# Altium schematic sheet Power Distrubition.SchDoc
size A4; SheetNumber: 3; SheetTotal: 4
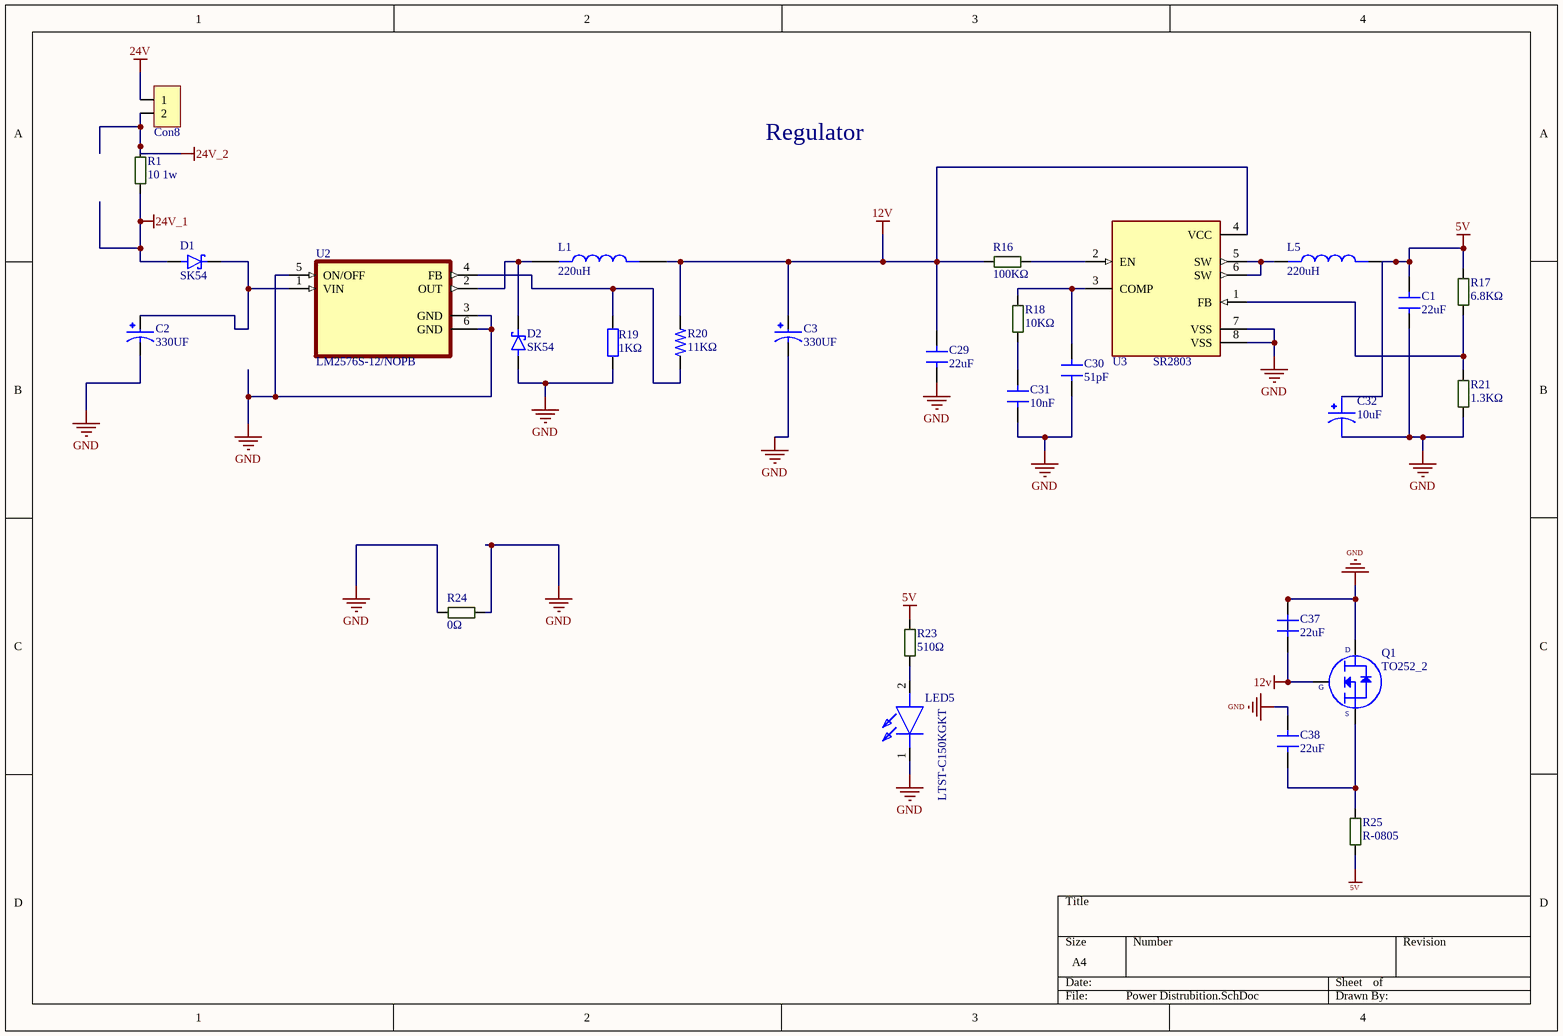
[diagram p0: Power Distrubition.SchDoc]

## Parts
C1  22uF  [C-0805]
C2  330UF  [CAP_EEETC1C331V]
C3  330UF  [CAP_EEETC1C331V]
C29  22uF  [C-0805]
C30  51pF  [C-0603W]
C31  10nF  [C-0805]
C32  10uF  [CapSmdElc]
C37  22uF  [C-0805]
C38  22uF  [C-0805]
Con8  Connector2_1  [Conn]  (value not drawn)
D1  SK54  [DIOM7959X265N]
D2  SK54  [DIOM7959X265N]
L1  220uH  [IND_MDH12577C-101MA=P3]
L5  220uH  [IND_MDH12577C-101MA=P3]
LED5  LTST-C150KGKT  [LED1206]
Q1  TO252_2  [TO-252]
R1  10 1w  [R-2512]
R16  100KΩ  [R-0805]
R17  6.8KΩ  [R-0603R]
R18  10KΩ  [R-0805]
R19  Deger: 1KΩ  [R-0805]  (hidden comment: RES SMD 1K OHM 1% 1/8W 0805)
R20  11KΩ  [R-0805]
R21  1.3KΩ  [R-0603R]
R23  510Ω  [R-0603R]
R24  0Ω  [R-2512]
R25  R-0805  [R-0805W]
U2  LM2576S-12/NOPB  [VREG_TPS79625KTTR]
U3  SR2803  [SOP127P600X175-8N]

## Nets
5V: C1.2 C32.1 L5.2 R17.2 R23.2 R25.1
12v: C3.1 C29.2 C37.1 L1.2 Q1.1 R16.2 R20.2 U3.4(VCC)
24V: Con8.1
24V_1: D1.A R1.1
24V_2: Con8.2 R1.2
GND: C1.1 C2.2 C3.2 C29.1 C30.1 C31.1 C32.2 C37.2 C38.2 D2.A LED5.1(K) Q1.4 R19.1 R21.1 R24.1 R24.2 U2.3(GND) U2.5(ON/OFF) U2.6(GND) U3.7(VSS) U3.8(VSS)
NetC2_1: C2.1 D1.C(K) U2.1(VIN)
NetC30_2: C30.2 R18.2 U3.3(COMP)
NetC31_2: C31.2 R18.1
NetC38_1: C38.1 Q1.3 R25.2
NetD2_C: D2.C(K) L1.1 U2.2(OUT)
NetL5_1: L5.1 U3.5(SW) U3.6(SW)
NetLED5_2: LED5.2(A) R23.1
NetR16_1: R16.1 U3.2(EN)
NetR17_1: R17.1 R21.2 U3.1(FB)
NetR19_2: R19.2 R20.1 U2.4(FB)

## Notes on the sheet
- Regulator
- (in symbol TO252_2) D; G; S

## Library data of the parts
C1 C29 C31 C37 C38 = C-0805
C2 C3 = CAP 330UF SMD: CAP ALUM 330UF 20% 16V SMD; MP: EEE-TC1C331V; MF: Panasonic Electronic Components; Value: *; Package: RADIAL-2 Panasonic; Availability: In Stock; SnapEDA_Link: https://www.snapeda.com/parts/EEE-TC1C331V/Panasonic/view-part/6178283/?ref=snap; Price: None; Purchase-URL: https://pricing.snapeda.com/search/part/EEE-TC1C331V/?ref=eda; Check_prices: https://www.snapeda.com/parts/EEE-TC1C331V/Panasonic/view-part/6178283/?ref=eda
C30 = C-0603
C32 = 100 uF Electr Cap
D1 D2 = SK54: Diode Schottky 40V 5A Surface Mount DO-214AA (SMB); MP: MBRS320T3G; MF: ON Semiconductor; Package: DO-214 ON Semiconductor; Availability: Good; Arrow_Electronics-Purchase-URL: https://snapeda.com/shop?store=Arrow+Electronics&id=432205; SnapEDA_Link: https://www.snapeda.com/parts/MBRS320T3G/ON%20Semiconductor/view-part/432205/?ref=snap; DigiKey-Purchase-URL: https://snapeda.com/shop?store=DigiKey&id=432205; Mouser-Purchase-URL: https://snapeda.com/shop?store=Mouser&id=432205; Value: *; Price: None
L1 L5 = 220uH Inductor SMD: Inductor Power Shielded Wirewound 220uH 20% 100KHz Ferrite 1.1A 0.325Ohm DCR 5049 Automotive T/R; MP: MDH12577C-101MA=P3; Package: None; Price: None; Value: *; Availability: Unavailable
LED5 = LTST-C150KGKT: LED; Manufacturer_Name: Lite-On; Datasheet Link: http://optoelectronics.liteon.com/upload/download/ds22-2000-072/ltst-c150kgkt.pdf; Height: 1.2mm; Manufacturer_Part_Number: LTST-C150KGKT; Mouser Part Number: 859-LTST-C150KGKT; Mouser Price/Stock: https://www.mouser.com/Search/Refine.aspx?Keyword=859-LTST-C150KGKT; RS Part Number: 6920871; RS Price/Stock: https://uk.rs-online.com/web/p/products/6920871
Q1 = TO252_2: Manufacturer: Infineon; Manufacturer Part Number: IRF3205STRLPBF; Drain to Source Voltage (Vdss): 55V; Continuous Drain Current (ID): 110A; Rds On Max: 8mR; Input Capacitance: 3.247nF; Max Power Dissipation: 200W; Turn-Off Delay Time: 50ns; Turn-On Delay Time: 14ns; Gate to Source Voltage (Vgs): 20V; Threshold Voltage: 4V; Supplier 1: Digi-Key; RoHS: Yes; Stock 1: 3281; Pricing 1: 1 = 1,84000, 10 = 1,66600, 100 = 1,33840 (USD); Mount: Surface Mount; Case/Package: D2PAK; Number of Pins: 3; Min Operating Temperature: -55°C; Max Operating Temperature: 175°C; Packaging: Cut Tape; Power Dissipation: 200W; Drain to Source Resistance: 8mR; Drain to Source Breakdown Voltage: 55V; Length: 0.42inch; Height: 0.19inch; Width: 0.38inch; REACH SVHC: No SVHC; Lead Free: Lead Free; ComponentLink1URL: https://www.alliedelec.com/m/d/b8827ca43655240244f0cc5c2198e6b1.pdf?src-supplier=Allied+Electronics; ComponentLink1Description: https://www.alliedelec.com/m/d/b8827ca43655240244f0cc5c2198e6b1.pdf?src-supplier=Allied+Electronics; ComponentLink2URL: https://www.infineon.com/dgdl/irf3205spbf.pdf?fileId=5546d462533600a4015355defac9190c&src-supplier=Digi-Key; ComponentLink2Description: https://www.infineon.com/dgdl/irf3205spbf.pdf?fileId=5546d462533600a4015355defac9190c&src-supplier=Digi-Key; ComponentLink3URL: http://www.infineon.com/dgdl/irf3205spbf.pdf?fileId=5546d462533600a4015355defac9190c&src-supplier=Digi-Key; ComponentLink3Description: http://www.infineon.com/dgdl/irf3205spbf.pdf?fileId=5546d462533600a4015355defac9190c&src-supplier=Digi-Key; ComponentLink4URL: http://www.farnell.com/datasheets/1884183.pdf?src-supplier=Element14; ComponentLink4Description: http://www.farnell.com/datasheets/1884183.pdf?src-supplier=Element14; Supplier Part Number 1: IRF3205STRLPBFCT-ND
R1 = R-2512
R16 R18 = R-0805
R17 R21 R23 = R-0603
R19 = 1K 0805: 1 kOhms ±1% 0.125W, 1/8W Chip Resistor 0805 (2012 Metric) Moisture Resistant Thick Film; Cins: Direnc; Uretici Kodu: RC0805FR-071KL; Kılıf: 0805; -Sicaklik: -55; +Sicaklik: +155; Lehim Yöntemi: SMD; MSL: 1 (Unlimited)
R20 = RES 11KΩ SMD: THICK FILM RESISTOR, 11KOHM, 125mW, 5%; MP: CRCW080511K0JNEA; Package: None; Price: None; Value: *; Availability: Unavailable
R24 = R-2512: 10 1w
U2 = LM2576S-12/NOPB: SIMPLE SWITCHER&reg; 40V, 3A Low Component Count Step-Down Regulator 5-DDPAK/TO-263 -40 to 125; MF: Texas Instruments; Availability: Warning; SnapEDA_Link: https://www.snapeda.com/parts/LM2576S-12/NOPB/Texas%20Instruments/view-part/470772/?ref=snap; Mouser-Purchase-URL: https://snapeda.com/shop?store=Mouser&id=470772; Texas_Instruments-Purchase-URL: https://snapeda.com/shop?store=Texas+Instruments&id=470772; Value: *; Price: None; Package: TO-263-5 Texas Instruments; DigiKey-Purchase-URL: https://snapeda.com/shop?store=DigiKey&id=470772; MP: LM2576S-12/NOPB; BuyPart: https://www.snapeda.com/parts/LM2576S-12/NOPB/Texas%20Instruments/view-part/470772/?ref=eda
U3 = SR2803: 330KHZ, 3A SYNCHRONOUS / BUCK CONTROLLER; MF: Taiwan Semiconductor Corporation; MP: TS2509CS RLG; Package: SOP-8 Taiwan Semiconductor; Check_prices: https://www.snapeda.com/parts/TS2509CS%20RLG/Taiwan+Semiconductor+Corporation/view-part/?ref=eda; Value: *; Price: None; Availability: In Stock; SnapEDA_Link: https://www.snapeda.com/parts/TS2509CS%20RLG/Taiwan+Semiconductor+Corporation/view-part/?ref=snap
Con8 = Connector2_1: System: Connector